# Altium project 5 volt.PrjPcb
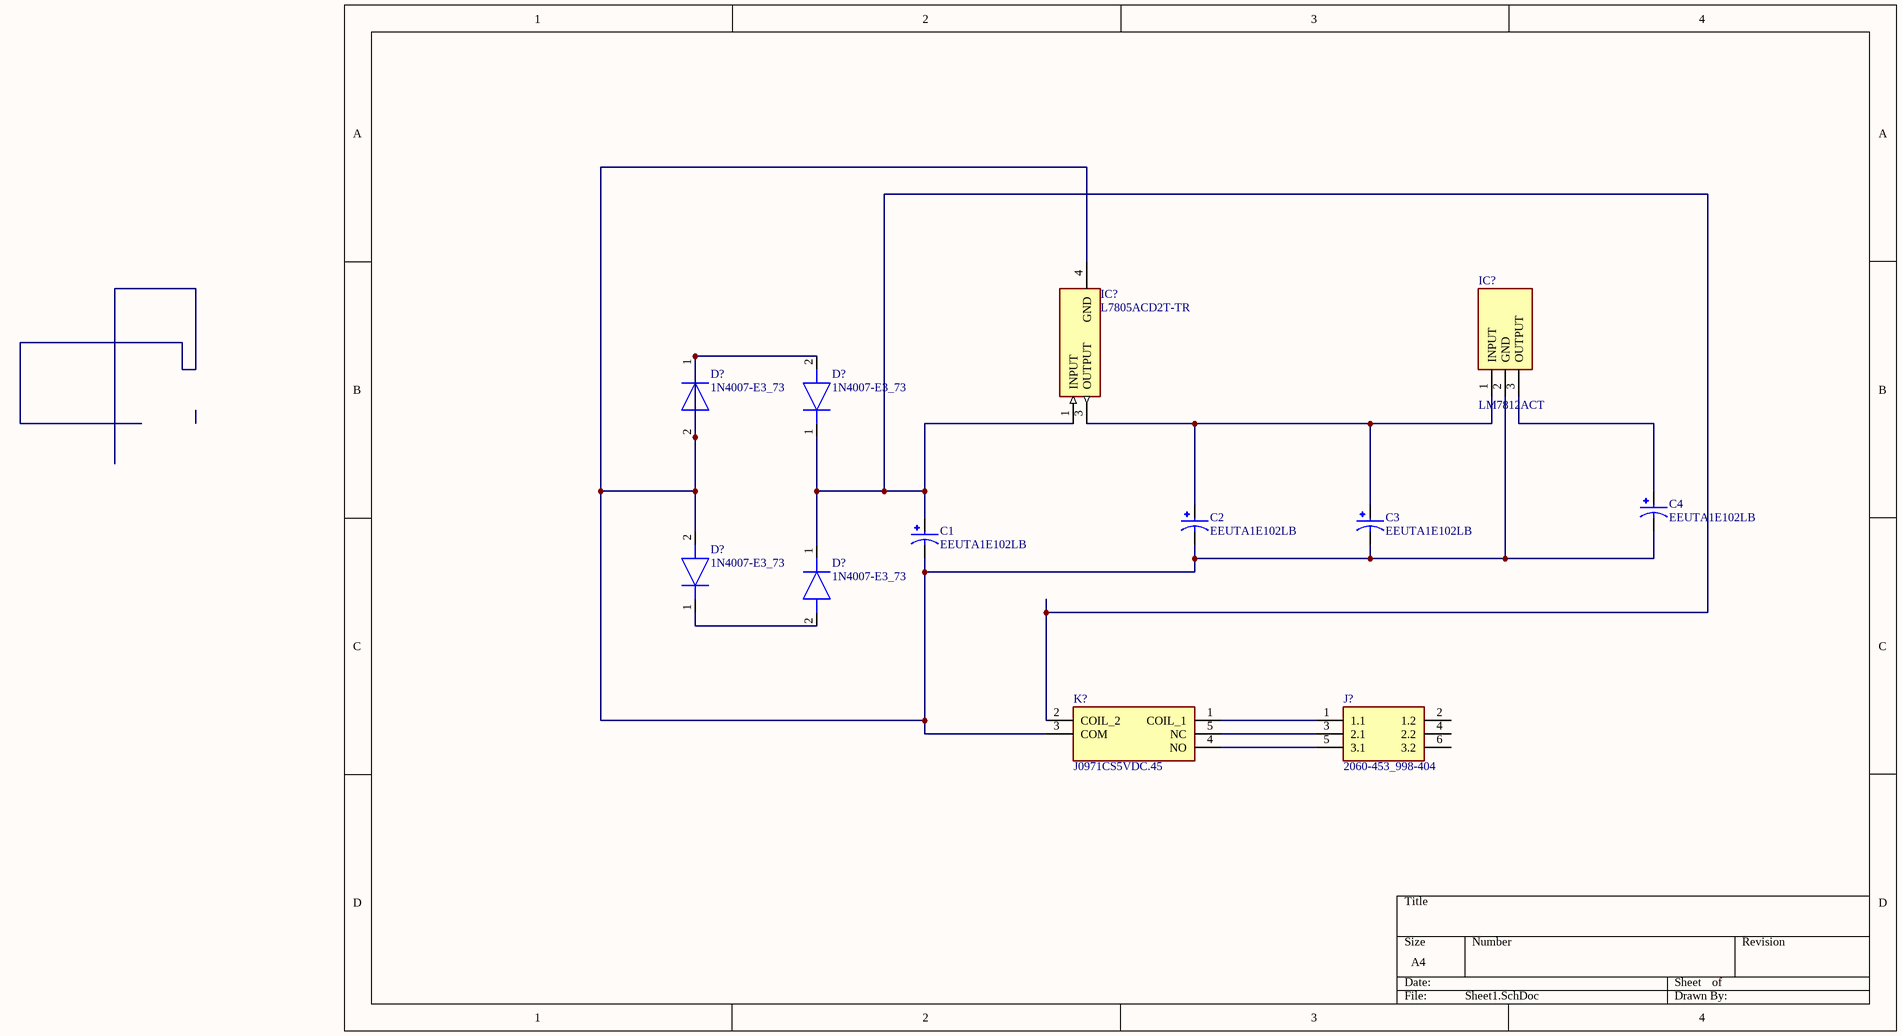
[diagram p0: Sheet1.SchDoc]
1 sheet, 12 parts. Net scope: global (net labels, ports and power ports of the same name join across sheets).
Board file: PCB1.PcbDoc

## Sheet Sheet1.SchDoc
size A4; SheetNumber: 1; SheetTotal: 1

### Parts
(Parts that share a designator on the sheet are numbered #1, #2 ... from top to bottom, then left to right.)
C1  EEUTA1E102LB  [CAPPRD500W60D1250H2500]
C2  EEUTA1E102LB  [CAPPRD500W60D1250H2500]
C3  EEUTA1E102LB  [CAPPRD500W60D1250H2500]
C4  EEUTA1E102LB  [CAPPRD500W60D1250H2500]
D?#1  1N4007-E3_73  [DIOAD1405W86L465D235]
D?#2  1N4007-E3_73  [DIOAD1405W86L465D235]
D?#3  1N4007-E3_73  [DIOAD1405W86L465D235]
D?#4  1N4007-E3_73  [DIOAD1405W86L465D235]
IC1  L7805ACD2T-TR  [D2PAK-STB35NF10T4]
IC?  LM7812ACT  [TO254P470X1016X2019-3P]
J?  2060-453_998-404  [2060453998404]
K?  J0971CS5VDC.45  [J0971CS5VDC45]

### Nets
NetC1_N: C1.N C2.N C3.N C4.N D?#1.1(K) D?#1.2(A) D?#2.2(A) D?#4.2(A) IC1.4(GND) IC?.2(GND) K?.3(COM)
NetC1_P: C1.P D?#2.1(K) D?#3.1(K) IC1.1(INPUT) K?.2(COIL_2)
NetC2_P: C2.P C3.P IC1.3(OUTPUT) IC?.1(INPUT)
NetC4_P: C4.P IC?.3(OUTPUT)
NetD?#3_2: D?#3.2(A) D?#4.1(K)
NetJ?_1: J?.1(1.1) K?.1(COIL_1)
NetJ?_3: J?.3(2.1) K?.5(NC)
NetJ?_5: J?.5(3.1) K?.4(NO)

Not connected (* = marked no-connect by the designer): J? 2(1.2) 4(2.2) 6(3.2)

### Library data of the parts
C1-C4 = EEUTA1E102LB: CAP ALUM 1000UF 20% 25V RADIAL; MF: Panasonic; MP: EEUTA1E102LB; Package: RADIAL-2 Panasonic; Availability: No availability data; Price: None; Check_prices: https://www.snapeda.com/parts/EEUTA1E102LB/Panasonic/view-part/5789306/?ref=eda; SnapEDA_Link: https://www.snapeda.com/parts/EEUTA1E102LB/Panasonic/view-part/5789306/?ref=snap; Value: *
D?#1-D?#4 = 1N4007-E3_73: Diode; Manufacturer_Name: Vishay; Manufacturer_Part_Number: 1N4007-E3/73; Datasheet Link: https://mouser.componentsearchengine.com/Datasheets/2/1N4007-E3_73.pdf; Mouser Part Number: 625-1N4007-E3/73; Mouser Price/Stock: https://www.mouser.co.uk/ProductDetail/Vishay-General-Semiconductor/1N4007-E3-73?qs=N4vtoAxH%2FSqT3Ng3e4K0Gw%3D%3D; Arrow Part Number: 1N4007-E3/73; Arrow Price/Stock: https://www.arrow.com/en/products/1n4007-e373/vishay?region=europe
IC1 = L7805ACD2T-TR: Integrated Circuit; Manufacturer_Name: STMicroelectronics; Datasheet Link: http://www.st.com/web/en/resource/technical/document/datasheet/CD00000444.pdf; Manufacturer_Part_Number: L7805ACD2T-TR; Mouser Part Number: 511-L7805ACD2T-TR; Mouser Price/Stock: https://www.mouser.co.uk/ProductDetail/STMicroelectronics/L7805ACD2T-TR?qs=Ctxo64yJVFuOLXlPPZdJUQ%3D%3D; Arrow Part Number: L7805ACD2T-TR; Arrow Price/Stock: https://www.arrow.com/en/products/l7805acd2t-tr/stmicroelectronics?region=europe
IC? = LM7812ACT: Integrated Circuit; Manufacturer_Name: onsemi; Datasheet Link: https://datasheet.datasheetarchive.com/originals/distributors/Datasheets_SAMA/704b005d7d2d9ced5864f40b6609c1bc.pdf; Height: 4.7mm; Manufacturer_Part_Number: LM7812ACT; Mouser Part Number: 512-LM7812ACT; Mouser Price/Stock: https://www.mouser.com/Search/Refine.aspx?Keyword=512-LM7812ACT; Arrow Part Number: LM7812ACT; Arrow Price/Stock: https://www.arrow.com/en/products/lm7812act/on-semiconductor
J? = 2060-453_998-404: Connector; Manufacturer_Name: Wago; Manufacturer_Part_Number: 2060-453/998-404; Datasheet Link: https://www.wago.com/2060-453/998-404; Height: 4.5mm; Arrow Part Number: 2060-453/998-404; Arrow Price/Stock: https://www.arrow.com/en/products/2060-453998-404/wago-kontakttechnik-gmbh?region=europe
K? = J0971CS5VDC.45: Relay or Contactor; Manufacturer_Name: CIT Relay & Switch; Datasheet Link: https://www.citrelay.com/Catalog Pages/RelayCatalog/J097.pdf; Height: 15.3mm; Manufacturer_Part_Number: J0971CS5VDC.45